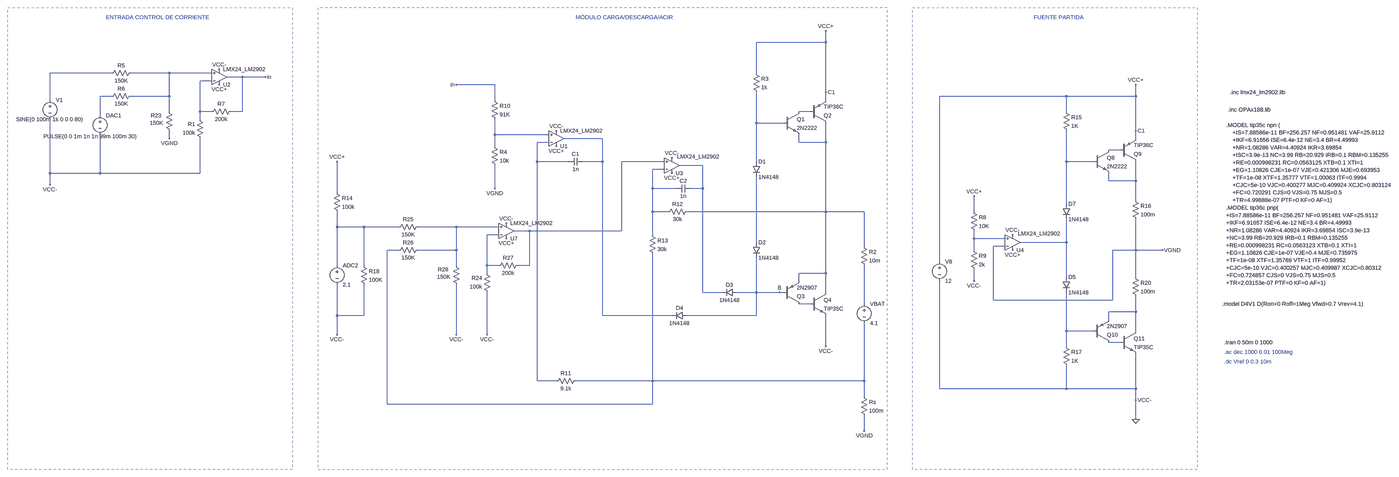
[diagram p0: schematic modulo_carga_descarga_ac_imp.asc, whole sheet]
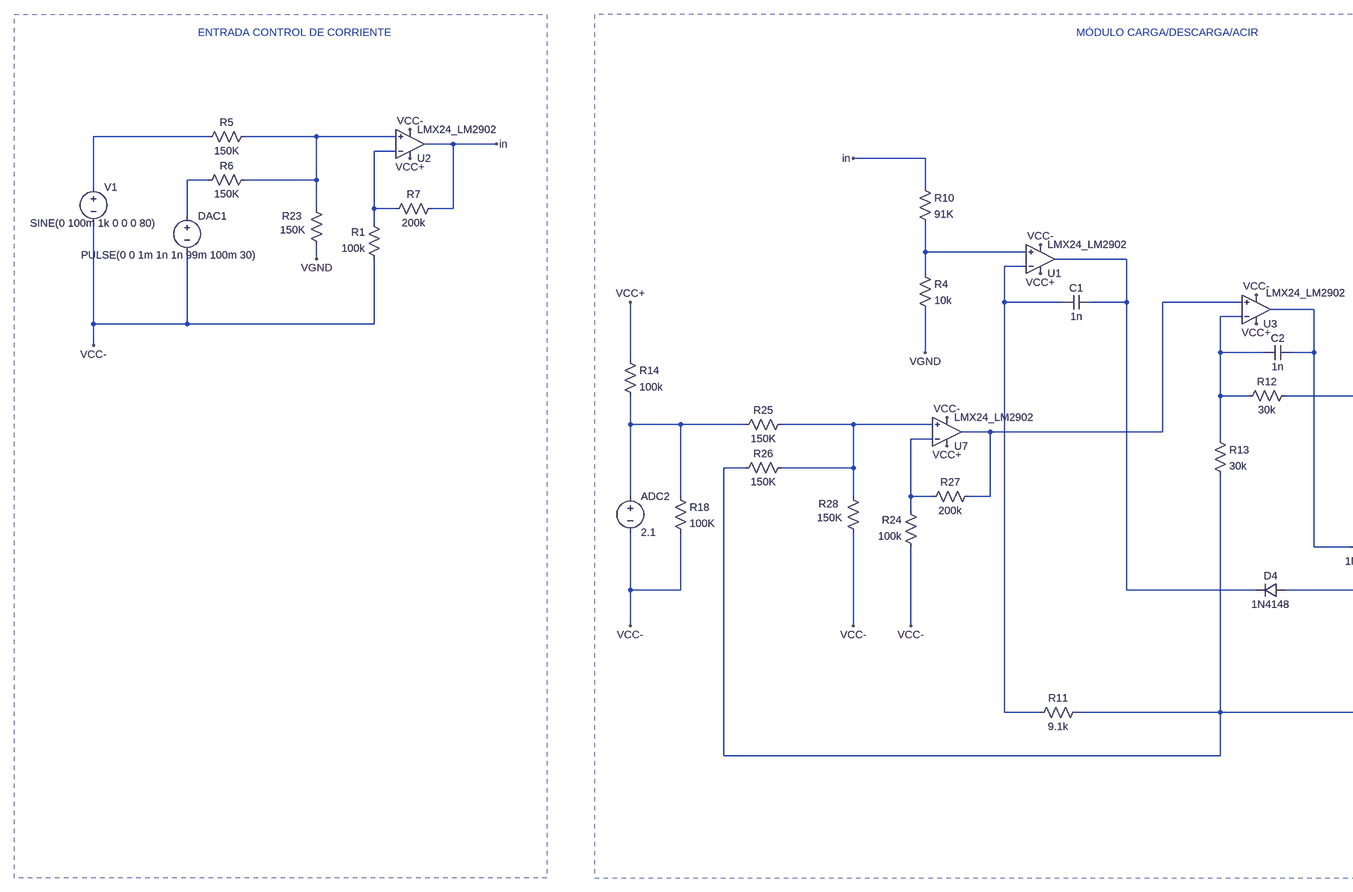
[diagram p1: schematic modulo_carga_descarga_ac_imp.asc, part, row 1 of 1, column 1 of 2]
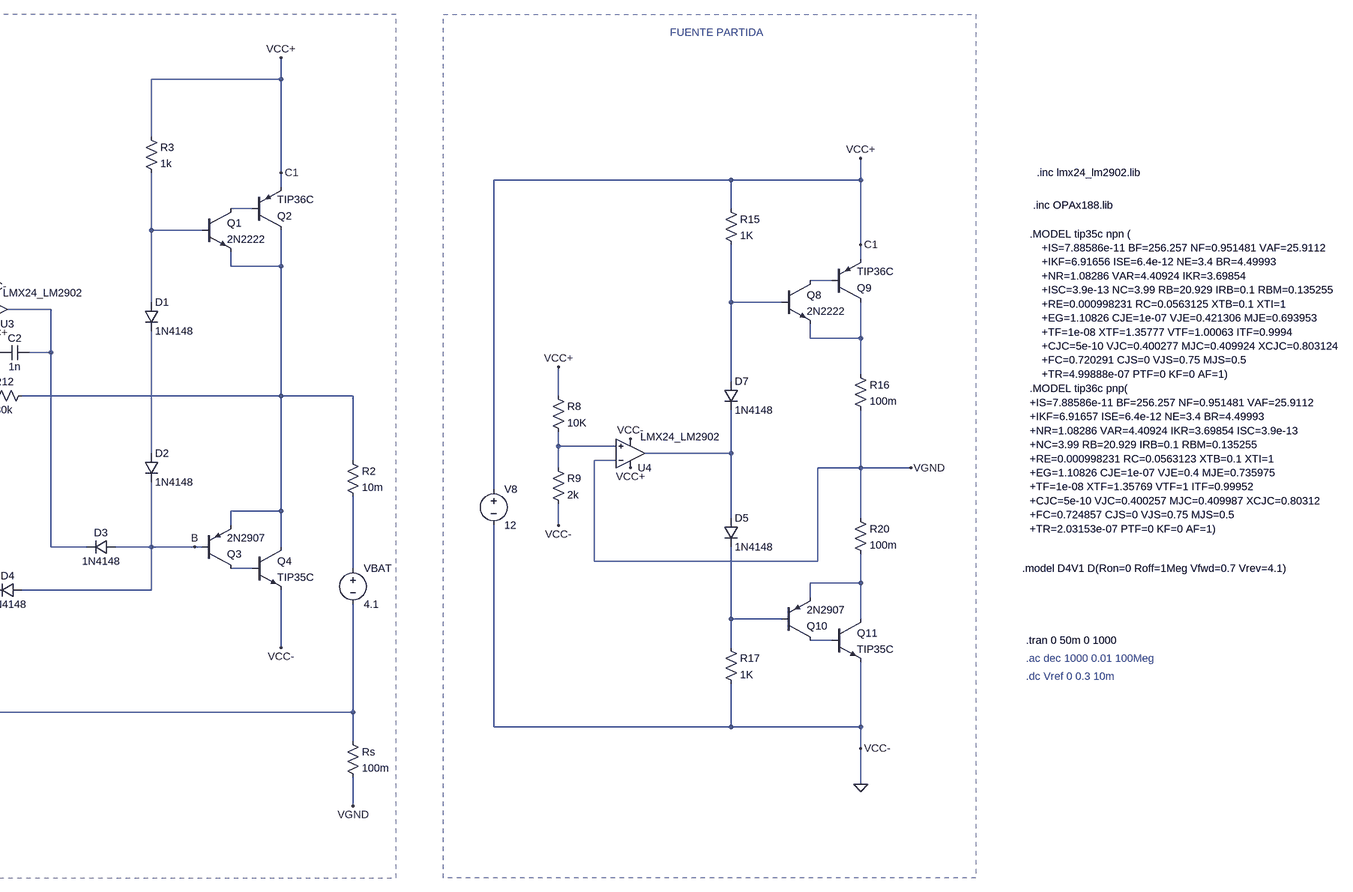
[diagram p2: schematic modulo_carga_descarga_ac_imp.asc, part, row 1 of 1, column 2 of 2]
modulo_carga_descarga_ac_imp.asc, the LTspice schematic file:
Version 4.1
SHEET 1 4748 1780
WIRE 1456 -1104 1456 -1152
WIRE 1456 -1104 1168 -1104
WIRE -1552 -976 -1808 -976
WIRE -1312 -976 -1472 -976
WIRE -1136 -976 -1312 -976
WIRE 1168 -976 1168 -1104
WIRE -1008 -960 -1072 -960
WIRE -912 -960 -1008 -960
WIRE -1136 -944 -1184 -944
WIRE 80 -928 -80 -928
WIRE 1456 -896 1456 -1104
WIRE -1552 -880 -1600 -880
WIRE -1312 -880 -1312 -976
WIRE -1312 -880 -1472 -880
WIRE 2512 -880 1984 -880
WIRE 2800 -880 2800 -928
WIRE 2800 -880 2512 -880
WIRE -1808 -864 -1808 -976
WIRE 80 -864 80 -928
WIRE 1456 -864 1456 -896
WIRE -1312 -816 -1312 -880
WIRE -1184 -816 -1184 -944
WIRE -1136 -816 -1184 -816
WIRE -1008 -816 -1008 -960
WIRE -1008 -816 -1056 -816
WIRE 1392 -816 1344 -816
WIRE 2512 -816 2512 -880
WIRE -1600 -800 -1600 -880
WIRE -1184 -784 -1184 -816
WIRE 1168 -768 1168 -896
WIRE 1280 -768 1168 -768
WIRE 2800 -736 2800 -880
WIRE 80 -720 80 -784
WIRE 304 -720 80 -720
WIRE -1312 -704 -1312 -736
WIRE 528 -704 368 -704
WIRE 2800 -704 2800 -736
WIRE 304 -688 256 -688
WIRE 1344 -688 1344 -720
WIRE 1456 -688 1456 -768
WIRE 1456 -688 1344 -688
WIRE 80 -672 80 -720
WIRE 2736 -656 2688 -656
WIRE 256 -608 256 -688
WIRE 384 -608 256 -608
WIRE 528 -608 528 -704
WIRE 528 -608 448 -608
WIRE 784 -608 608 -608
WIRE 1168 -608 1168 -768
WIRE 2512 -608 2512 -736
WIRE 2624 -608 2512 -608
WIRE 944 -592 848 -592
WIRE 784 -576 736 -576
WIRE -1808 -560 -1808 -784
WIRE -1600 -560 -1600 -720
WIRE -1600 -560 -1808 -560
WIRE -1184 -560 -1184 -704
WIRE -1184 -560 -1600 -560
WIRE 2688 -528 2688 -560
WIRE 2800 -528 2800 -608
WIRE 2800 -528 2688 -528
WIRE -1808 -512 -1808 -560
WIRE 80 -496 80 -592
WIRE 736 -496 736 -576
WIRE 832 -496 736 -496
WIRE 944 -496 944 -592
WIRE 944 -496 896 -496
WIRE -576 -480 -576 -608
WIRE 2800 -448 2800 -528
WIRE 2512 -432 2512 -608
WIRE 736 -400 736 -496
WIRE 800 -400 736 -400
WIRE 1456 -400 1456 -688
WIRE 1456 -400 880 -400
WIRE 1616 -400 1456 -400
WIRE 2128 -400 2128 -464
WIRE -576 -336 -576 -400
WIRE -464 -336 -576 -336
WIRE -320 -336 -464 -336
WIRE -80 -336 -240 -336
WIRE 96 -336 -80 -336
WIRE 224 -320 160 -320
WIRE 608 -320 608 -608
WIRE 608 -320 224 -320
WIRE 96 -304 48 -304
WIRE 736 -304 736 -400
WIRE 2128 -288 2128 -320
WIRE 2256 -288 2128 -288
WIRE 1168 -272 1168 -544
WIRE 2512 -272 2512 -368
WIRE 2512 -272 2320 -272
WIRE 1616 -256 1616 -400
WIRE 2256 -256 2208 -256
WIRE -320 -240 -368 -240
WIRE -80 -240 -80 -336
WIRE -80 -240 -240 -240
WIRE 2128 -240 2128 -288
WIRE 2800 -240 2800 -368
WIRE 2800 -240 2704 -240
WIRE 2912 -240 2800 -240
WIRE 1984 -192 1984 -880
WIRE -576 -176 -576 -336
WIRE -464 -176 -464 -336
WIRE -80 -176 -80 -240
WIRE 48 -176 48 -304
WIRE 96 -176 48 -176
WIRE 224 -176 224 -320
WIRE 224 -176 176 -176
WIRE 48 -144 48 -176
WIRE 1456 -144 1456 -400
WIRE 1456 -144 1344 -144
WIRE 2512 -128 2512 -272
WIRE 2800 -128 2800 -240
WIRE 1344 -112 1344 -144
WIRE 2128 -112 2128 -160
WIRE 944 -64 944 -496
WIRE 1024 -64 944 -64
WIRE 1168 -64 1168 -208
WIRE 1168 -64 1088 -64
WIRE 1264 -64 1168 -64
WIRE 1280 -64 1264 -64
WIRE 1456 -64 1456 -144
WIRE 2208 -32 2208 -256
WIRE 2704 -32 2704 -240
WIRE 2704 -32 2208 -32
WIRE 1392 -16 1344 -16
WIRE 1616 -16 1616 -176
WIRE 2800 16 2800 -48
WIRE 2800 16 2688 16
WIRE -576 32 -576 -96
WIRE -464 32 -464 -96
WIRE -464 32 -576 32
WIRE 528 32 528 -608
WIRE 816 32 528 32
WIRE 1168 32 1168 -64
WIRE 1168 32 880 32
WIRE 2688 48 2688 16
WIRE 2512 96 2512 -64
WIRE 2624 96 2512 96
WIRE 2800 96 2800 16
WIRE -576 112 -576 32
WIRE -80 112 -80 -96
WIRE 48 112 48 -64
WIRE 2736 144 2688 144
WIRE 1456 160 1456 32
WIRE 2512 160 2512 96
WIRE 256 304 256 -608
WIRE 336 304 256 304
WIRE 736 304 736 -224
WIRE 736 304 416 304
WIRE 1616 304 1616 64
WIRE 1616 304 736 304
WIRE 1984 336 1984 -112
WIRE 2512 336 2512 240
WIRE 2512 336 1984 336
WIRE 2800 336 2800 192
WIRE 2800 336 2512 336
WIRE 1616 368 1616 304
WIRE 2800 384 2800 336
WIRE -368 400 -368 -240
WIRE 736 400 736 304
WIRE 736 400 -368 400
WIRE 2800 464 2800 384
WIRE 1616 512 1616 448
FLAG 336 -672 VCC+
FLAG 1456 -896 C1
FLAG 1264 -64 B
FLAG 336 -736 VCC-
FLAG 816 -560 VCC+
FLAG 816 -624 VCC-
FLAG 1456 -1152 VCC+
FLAG 1456 160 VCC-
FLAG 1616 512 VGND
FLAG 2800 -736 C1
FLAG 2800 -928 VCC+
FLAG 2800 384 VCC-
FLAG 2912 -240 VGND
FLAG 2800 464 0
FLAG 80 -496 VGND
FLAG -1104 -928 VCC+
FLAG -1104 -992 VCC-
FLAG -1808 -512 VCC-
FLAG -80 -928 in
FLAG 2288 -240 VCC+
FLAG 2288 -304 VCC-
FLAG 2128 -464 VCC+
FLAG 2128 -112 VCC-
FLAG -576 112 VCC-
FLAG -912 -960 in
FLAG -1312 -704 VGND
FLAG 128 -288 VCC+
FLAG 128 -352 VCC-
FLAG -80 112 VCC-
FLAG -576 -608 VCC+
FLAG 48 112 VCC-
SYMBOL res 1600 352 R0
SYMATTR InstName Rs
SYMATTR Value 100m
SYMBOL npn 1280 -816 R0
SYMATTR InstName Q1
SYMATTR Value 2N2222
SYMBOL pnp 1392 -768 M180
SYMATTR InstName Q2
SYMATTR Value TIP36C
SYMBOL pnp 1280 -16 M180
SYMATTR InstName Q3
SYMATTR Value 2N2907
SYMBOL npn 1392 -64 R0
SYMATTR InstName Q4
SYMATTR Value TIP35C
SYMBOL voltage 1616 -32 R0
WINDOW 123 0 0 Left 0
WINDOW 39 0 0 Left 0
SYMATTR InstName VBAT
SYMATTR Value 4.1
SYMBOL res 64 -688 R0
SYMATTR InstName R4
SYMATTR Value 10k
SYMBOL res 64 -880 R0
SYMATTR InstName R10
SYMATTR Value 91K
SYMBOL diode 1152 -272 R0
SYMATTR InstName D2
SYMATTR Value 1N4148
SYMBOL res 1152 -992 R0
SYMATTR InstName R3
SYMATTR Value 1k
SYMBOL OpAmps\\opamp2 336 -640 M180
SYMATTR InstName U1
SYMATTR Value LMX24_LM2902
SYMBOL cap 448 -624 R90
WINDOW 0 0 32 VBottom 2
WINDOW 3 32 32 VTop 2
SYMATTR InstName C1
SYMATTR Value 1n
SYMBOL res 432 288 R90
WINDOW 0 0 56 VBottom 2
WINDOW 3 32 56 VTop 2
SYMATTR InstName R11
SYMATTR Value 9.1k
SYMBOL diode 1088 -80 R90
WINDOW 0 0 32 VBottom 2
WINDOW 3 32 32 VTop 2
SYMATTR InstName D3
SYMATTR Value 1N4148
SYMBOL OpAmps\\opamp2 816 -528 M180
WINDOW 3 22 101 Left 2
SYMATTR Value LMX24_LM2902
SYMATTR InstName U3
SYMBOL cap 896 -512 R90
WINDOW 0 0 32 VBottom 2
WINDOW 3 32 32 VTop 2
SYMATTR InstName C2
SYMATTR Value 1n
SYMBOL voltage -576 -192 R0
WINDOW 123 0 0 Left 0
WINDOW 39 0 0 Left 0
SYMATTR InstName ADC2
SYMATTR Value 2.1
SYMBOL res 720 -320 R0
SYMATTR InstName R13
SYMATTR Value 30k
SYMBOL res 896 -416 R90
WINDOW 0 0 56 VBottom 2
WINDOW 3 32 56 VTop 2
SYMATTR InstName R12
SYMATTR Value 30k
SYMBOL diode 1152 -608 R0
SYMATTR InstName D1
SYMATTR Value 1N4148
SYMBOL diode 880 16 R90
WINDOW 0 0 32 VBottom 2
WINDOW 3 32 32 VTop 2
SYMATTR InstName D4
SYMATTR Value 1N4148
SYMBOL voltage 1984 -208 R0
WINDOW 123 0 0 Left 0
WINDOW 39 0 0 Left 0
SYMATTR InstName V8
SYMATTR Value 12
SYMBOL npn 2624 -656 R0
SYMATTR InstName Q8
SYMATTR Value 2N2222
SYMBOL pnp 2736 -608 M180
SYMATTR InstName Q9
SYMATTR Value TIP36C
SYMBOL pnp 2624 144 M180
SYMATTR InstName Q10
SYMATTR Value 2N2907
SYMBOL npn 2736 96 R0
SYMATTR InstName Q11
SYMATTR Value TIP35C
SYMBOL diode 2496 -128 R0
SYMATTR InstName D5
SYMATTR Value 1N4148
SYMBOL res 2496 -832 R0
SYMATTR InstName R15
SYMATTR Value 1K
SYMBOL diode 2496 -432 R0
SYMATTR InstName D7
SYMATTR Value 1N4148
SYMBOL res 2784 -464 R0
SYMATTR InstName R16
SYMATTR Value 100m
SYMBOL res 2496 144 R0
SYMATTR InstName R17
SYMATTR Value 1K
SYMBOL res 2784 -144 R0
SYMATTR InstName R20
SYMATTR Value 100m
SYMBOL res 1600 -272 R0
SYMATTR InstName R2
SYMATTR Value 10m
SYMBOL OpAmps\\opamp2 -1104 -896 M180
SYMATTR InstName U2
SYMATTR Value LMX24_LM2902
SYMBOL res -1168 -688 R180
WINDOW 0 36 76 Left 2
WINDOW 3 36 40 Left 2
SYMATTR InstName R1
SYMATTR Value 100k
SYMBOL res -1456 -992 R90
WINDOW 0 0 56 VBottom 2
WINDOW 3 32 56 VTop 2
SYMATTR InstName R5
SYMATTR Value 150K
SYMBOL res -1456 -896 R90
WINDOW 0 0 56 VBottom 2
WINDOW 3 32 56 VTop 2
SYMATTR InstName R6
SYMATTR Value 150K
SYMBOL voltage -1600 -816 R0
WINDOW 3 -236 103 Left 2
WINDOW 123 0 0 Left 0
WINDOW 39 0 0 Left 0
SYMATTR Value PULSE(0 0 1m 1n 1n 99m 100m 30)
SYMATTR InstName DAC1
SYMBOL res -1040 -832 R90
WINDOW 0 0 56 VBottom 2
WINDOW 3 32 56 VTop 2
SYMATTR InstName R7
SYMATTR Value 200k
SYMBOL OpAmps\\opamp2 2288 -208 M180
WINDOW 3 22 101 Left 2
SYMATTR Value LMX24_LM2902
SYMATTR InstName U4
SYMBOL res 2112 -416 R0
SYMATTR InstName R8
SYMATTR Value 10K
SYMBOL res 2112 -256 R0
SYMATTR InstName R9
SYMATTR Value 2k
SYMBOL voltage -1808 -880 R0
WINDOW 3 -141 96 Left 2
WINDOW 123 0 0 Left 0
WINDOW 39 0 0 Left 0
SYMATTR Value SINE(0 100m 1k 0 0 0 80)
SYMATTR InstName V1
SYMBOL res -1328 -832 R0
WINDOW 0 -61 32 Left 2
WINDOW 3 -65 63 Left 2
SYMATTR InstName R23
SYMATTR Value 150K
SYMBOL OpAmps\\opamp2 128 -256 M180
SYMATTR InstName U7
SYMATTR Value LMX24_LM2902
SYMBOL res 64 -48 R180
WINDOW 0 36 76 Left 2
WINDOW 3 36 40 Left 2
SYMATTR InstName R24
SYMATTR Value 100k
SYMBOL res -224 -352 R90
WINDOW 0 0 56 VBottom 2
WINDOW 3 32 56 VTop 2
SYMATTR InstName R25
SYMATTR Value 150K
SYMBOL res -224 -256 R90
WINDOW 0 0 56 VBottom 2
WINDOW 3 32 56 VTop 2
SYMATTR InstName R26
SYMATTR Value 150K
SYMBOL res 192 -192 R90
WINDOW 0 0 56 VBottom 2
WINDOW 3 32 56 VTop 2
SYMATTR InstName R27
SYMATTR Value 200k
SYMBOL res -96 -192 R0
WINDOW 0 -61 32 Left 2
WINDOW 3 -65 63 Left 2
SYMATTR InstName R28
SYMATTR Value 150K
SYMBOL res -592 -496 R0
SYMATTR InstName R14
SYMATTR Value 100k
SYMBOL res -480 -192 R0
SYMATTR InstName R18
SYMATTR Value 100K
TEXT 3296 144 Left 2 !.tran 0 50m 0 1000
TEXT 3296 184 Left 2 ;.ac dec 1000 0.01 100Meg
TEXT 3296 224 Left 2 ;.dc Vref 0 0.3 10m
TEXT 3304 -760 Left 2 !.MODEL tip35c npn (\n    +IS=7.88586e-11 BF=256.257 NF=0.951481 VAF=25.9112\n    +IKF=6.91656 ISE=6.4e-12 NE=3.4 BR=4.49993\n    +NR=1.08286 VAR=4.40924 IKR=3.69854\n    +ISC=3.9e-13 NC=3.99 RB=20.929 IRB=0.1 RBM=0.135255\n    +RE=0.000998231 RC=0.0563125 XTB=0.1 XTI=1\n    +EG=1.10826 CJE=1e-07 VJE=0.421306 MJE=0.693953\n    +TF=1e-08 XTF=1.35777 VTF=1.00063 ITF=0.9994\n    +CJC=5e-10 VJC=0.400277 MJC=0.409924 XCJC=0.803124\n    +FC=0.720291 CJS=0 VJS=0.75 MJS=0.5\n    +TR=4.99888e-07 PTF=0 KF=0 AF=1)
TEXT 3304 -416 Left 2 !.MODEL tip36c pnp(\n+IS=7.88586e-11 BF=256.257 NF=0.951481 VAF=25.9112\n+IKF=6.91657 ISE=6.4e-12 NE=3.4 BR=4.49993\n+NR=1.08286 VAR=4.40924 IKR=3.69854 ISC=3.9e-13\n+NC=3.99 RB=20.929 IRB=0.1 RBM=0.135255\n+RE=0.000998231 RC=0.0563123 XTB=0.1 XTI=1\n+EG=1.10826 CJE=1e-07 VJE=0.4 MJE=0.735975\n+TF=1e-08 XTF=1.35769 VTF=1 ITF=0.99952\n+CJC=5e-10 VJC=0.400257 MJC=0.409987 XCJC=0.80312\n+FC=0.724857 CJS=0 VJS=0.75 MJS=0.5\n+TR=2.03153e-07 PTF=0 KF=0 AF=1)
TEXT 3312 -824 Left 2 !.inc OPAx188.lib
TEXT 3288 -16 Left 2 !.model D4V1 D(Ron=0 Roff=1Meg Vfwd=0.7 Vrev=4.1)
TEXT 3320 -896 Left 2 !.inc lmx24_lm2902.lib
TEXT 2376 -1208 Left 2 ;FUENTE PARTIDA
TEXT 416 -1208 Left 2 ;MÓDULO CARGA/DESCARGA/ACIR
TEXT -1576 -1208 Left 2 ;ENTRADA CONTROL DE CORRIENTE
RECTANGLE Normal 3056 672 1872 -1248 2
RECTANGLE Normal -656 672 1712 -1248 2
RECTANGLE Normal -800 672 -1984 -1248 2

The netlist it stands for:
* modulo_carga_descarga_ac_imp.asc
Rs N023 VGND 100m
Q1 N005 N006 N010 0 2N2222
Q2 N010 N005 C1 0 TIP36C
Q3 N024 B N010 0 2N2907
Q4 N010 N024 0 0 TIP35C
VBAT N025 N023 4.1
R4 N007 VGND 10k
R10 in N007 91K
D2 N021 B 1N4148
R3 C1 N006 1k
X§U1 N007 N009 C1 0 N008 LMX24_LM2902  ; pins In+ In- V+ V- OUT
C1 N008 N009 1n
R11 N023 N009 9.1k
D3 B N014 1N4148
X§U3 N012 N015 C1 0 N014 LMX24_LM2902  ; pins In+ In- V+ V- OUT
C2 N014 N015 1n
V§ADC2 N017 0 2.1
R13 N015 N023 30k
R12 N010 N015 30k
D1 N006 N021 1N4148
D4 B N008 1N4148
V8 C1 0 12
Q8 N011 N013 N016 0 2N2222
Q9 N016 N011 C1 0 TIP36C
Q10 N028 N027 N026 0 2N2907
Q11 N026 N028 0 0 TIP35C
D5 N022 N027 1N4148
R15 C1 N013 1K
D7 N013 N022 1N4148
R16 N016 VGND 100m
R17 N027 0 1K
R20 VGND N026 100m
R2 N010 N025 10m
X§U2 N002 N003 C1 0 in LMX24_LM2902  ; pins In+ In- V+ V- OUT
R1 0 N003 100k
R5 N002 N001 150K
R6 N002 N004 150K
V§DAC1 N004 0 PULSE(0 0 1m 1n 1n 99m 100m 30)
R7 in N003 200k
X§U4 N020 VGND C1 0 N022 LMX24_LM2902  ; pins In+ In- V+ V- OUT
R8 C1 N020 10K
R9 N020 0 2k
V1 N001 0 SINE(0 100m 1k 0 0 0 80)
R23 N002 VGND 150K
X§U7 N018 N019 C1 0 N012 LMX24_LM2902  ; pins In+ In- V+ V- OUT
R24 0 N019 100k
R25 N018 N017 150K
R26 N018 N023 150K
R27 N012 N019 200k
R28 N018 0 150K
R14 C1 N017 100k
R18 N017 0 100K
.model D D
.lib standard.dio
.model NPN NPN
.model PNP PNP
.lib standard.bjt
.tran 0 50m 0 1000
* .ac dec 1000 0.01 100Meg
* .dc Vref 0 0.3 10m
.MODEL tip35c npn (
    +IS=7.88586e-11 BF=256.257 NF=0.951481 VAF=25.9112
    +IKF=6.91656 ISE=6.4e-12 NE=3.4 BR=4.49993
    +NR=1.08286 VAR=4.40924 IKR=3.69854
    +ISC=3.9e-13 NC=3.99 RB=20.929 IRB=0.1 RBM=0.135255
    +RE=0.000998231 RC=0.0563125 XTB=0.1 XTI=1
    +EG=1.10826 CJE=1e-07 VJE=0.421306 MJE=0.693953
    +TF=1e-08 XTF=1.35777 VTF=1.00063 ITF=0.9994
    +CJC=5e-10 VJC=0.400277 MJC=0.409924 XCJC=0.803124
    +FC=0.720291 CJS=0 VJS=0.75 MJS=0.5
    +TR=4.99888e-07 PTF=0 KF=0 AF=1)
.MODEL tip36c pnp(
+IS=7.88586e-11 BF=256.257 NF=0.951481 VAF=25.9112
+IKF=6.91657 ISE=6.4e-12 NE=3.4 BR=4.49993
+NR=1.08286 VAR=4.40924 IKR=3.69854 ISC=3.9e-13
+NC=3.99 RB=20.929 IRB=0.1 RBM=0.135255
+RE=0.000998231 RC=0.0563123 XTB=0.1 XTI=1
+EG=1.10826 CJE=1e-07 VJE=0.4 MJE=0.735975
+TF=1e-08 XTF=1.35769 VTF=1 ITF=0.99952
+CJC=5e-10 VJC=0.400257 MJC=0.409987 XCJC=0.80312
+FC=0.724857 CJS=0 VJS=0.75 MJS=0.5
+TR=2.03153e-07 PTF=0 KF=0 AF=1)
.inc OPAx188.lib
.model D4V1 D(Ron=0 Roff=1Meg Vfwd=0.7 Vrev=4.1)
.inc lmx24_lm2902.lib
* FUENTE PARTIDA
* MÓDULO CARGA/DESCARGA/ACIR
* ENTRADA CONTROL DE CORRIENTE
.backanno
.end